# Altium schematic sheet LFO.SchDoc
size 246 x 182 mm
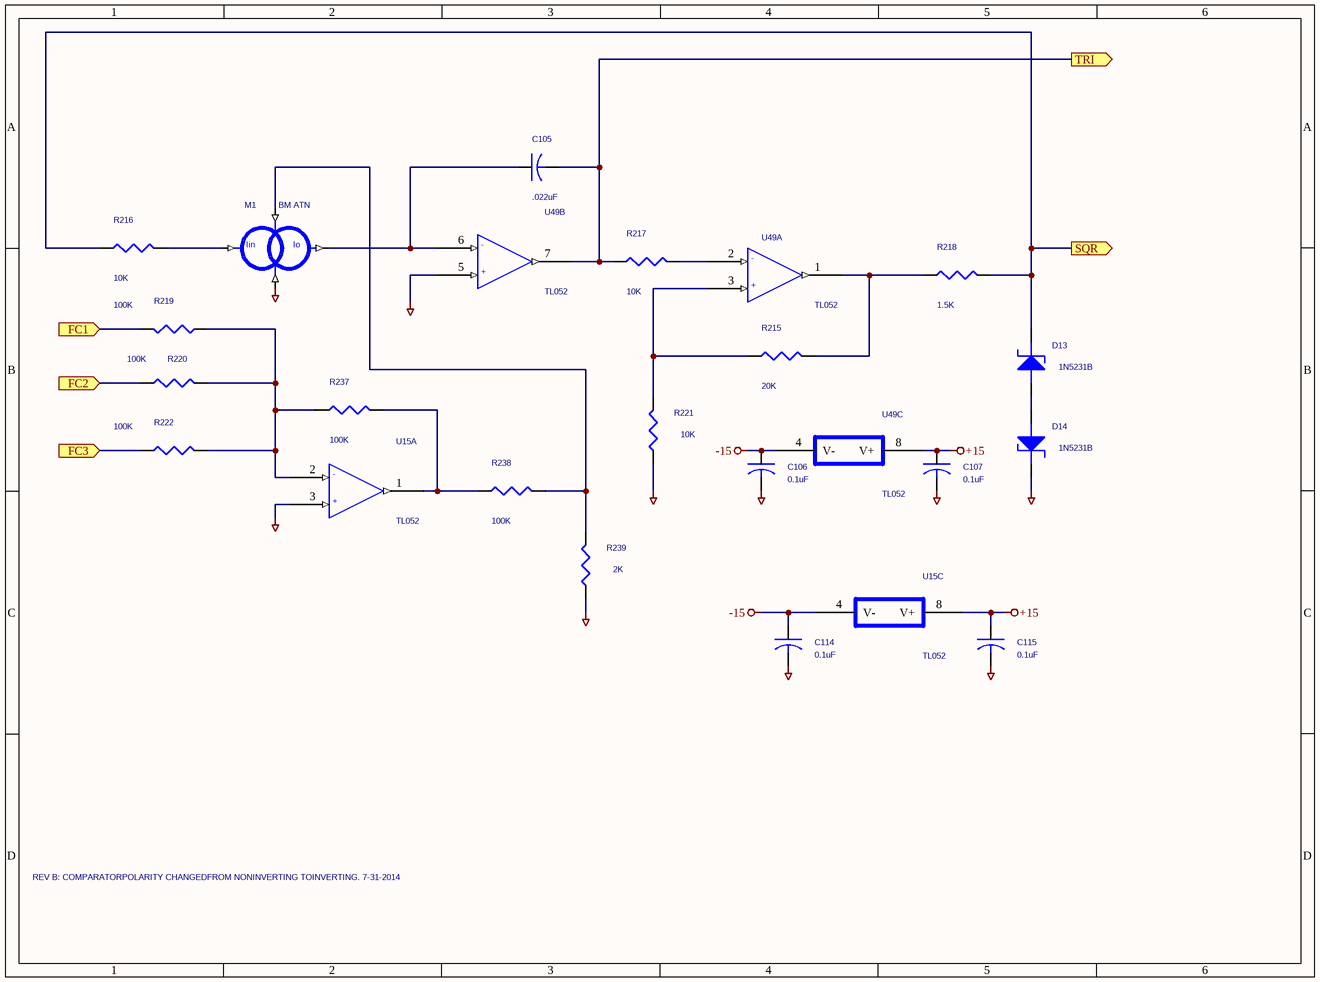
[diagram p0: LFO.SchDoc]

## Parts
C105  .022uF  [CAP-MY0.2X.1]
C106  0.1uF  [AXIALCAP0.3]
C107  0.1uF  [AXIALCAP0.3]
C114  0.1uF  [AXIALCAP0.3]
C115  0.1uF  [AXIALCAP0.3]
D13  1N5231B  [DIODE0.4]
D14  1N5231B  [DIODE0.4]
M1  BM ATN
R215  20K  [AXIAL0.4]
R216  10K  [AXIAL0.4]
R217  10K  [AXIAL0.4]
R218  1.5K  [AXIAL0.4]
R219  100K  [AXIAL0.4]
R220  100K  [AXIAL0.4]
R221  10K  [AXIAL0.4]
R222  100K  [AXIAL0.4]
R237  100K  [AXIAL0.4]
R238  100K  [AXIAL0.4]
R239  2K  [AXIAL0.4]
U15  TL052  [DIP8]  (parts A,C of 3)
U49  TL052  [DIP8]  (parts A,B,C of 3)

## Ports
FC1 (in), FC2 (in), FC3 (in), SQR (out), TRI (out)

## Nets
+15: C107.1 C115.1 U15.8(V+) U49.8(V+)
-15: C106.1 C114.1 U15.4(V-) U49.4(V-)
AGND: C106.2 C107.2 C114.2 C115.2 D14.CATHODE M1.CVP R221.1 R239.1 U15.3(+) U49.5(+)
FC1: R219.2 ; port FC1
FC2: R220.1 ; port FC2
FC3: R222.1 ; port FC3
SQR: D13.CATHODE R216.1 R218.2 ; port SQR
TRI: C105.2 R217.1 U49.7(OUT) ; port TRI
NetC105_1: C105.1 M1.Io U49.6(-)
NetD13_ANODE: D13.ANODE D14.ANODE
NetM1_CVN: M1.CVN R238.2 R239.2
NetM1_Iin: M1.Iin R216.2
NetR215_1: R215.1 R221.2 U49.3(+)
NetR215_2: R215.2 R218.1 U49.1(OUT)
NetR217_2: R217.2 U49.2(-)
NetR219_1: R219.1 R220.2 R222.2 R237.1 U15.2(-)
NetR237_2: R237.2 R238.1 U15.1(OUT)

## Notes on the sheet
- REV B: COMPARATORPOLARITY CHANGEDFROM NONINVERTING TOINVERTING. 7-31-2014

## Library data of the parts
C105-C107 C114 C115 = CAP_Dup1
D13 D14 = DIODE ZENER_Dup1: DIGIKEY PN: 1N5231BFSCT-ND
R215-R222 R237-R239 = R_Dup1
  R215: MOUSER PN: 271-20K-RC
  R216 R217 R221: MOUSER PN: 271-10K-RC
  R218: MOUSER PN: 271-1.5K-RC
  R219 R220 R222: MOUSER PN: 271-100K-RC
  R239: MOUSER PN: 271-2K-RC
U15 = GEN DUAL OPAMP-H: PACKAGE: GLIDE2
U49 = TL052N: PACKAGE: LFO_1; DIGIKEY PN: 296-7163-5-ND
M1 = BM ATN: TitleBlock_2_Page_Number: =M1_1_TitleBlock_2_Page_Number; TitleBlock_2_Title: =M1_1_TitleBlock_2_Title